# EAGLE design Cartucho Sin Led (EAGLE 9.6.2)
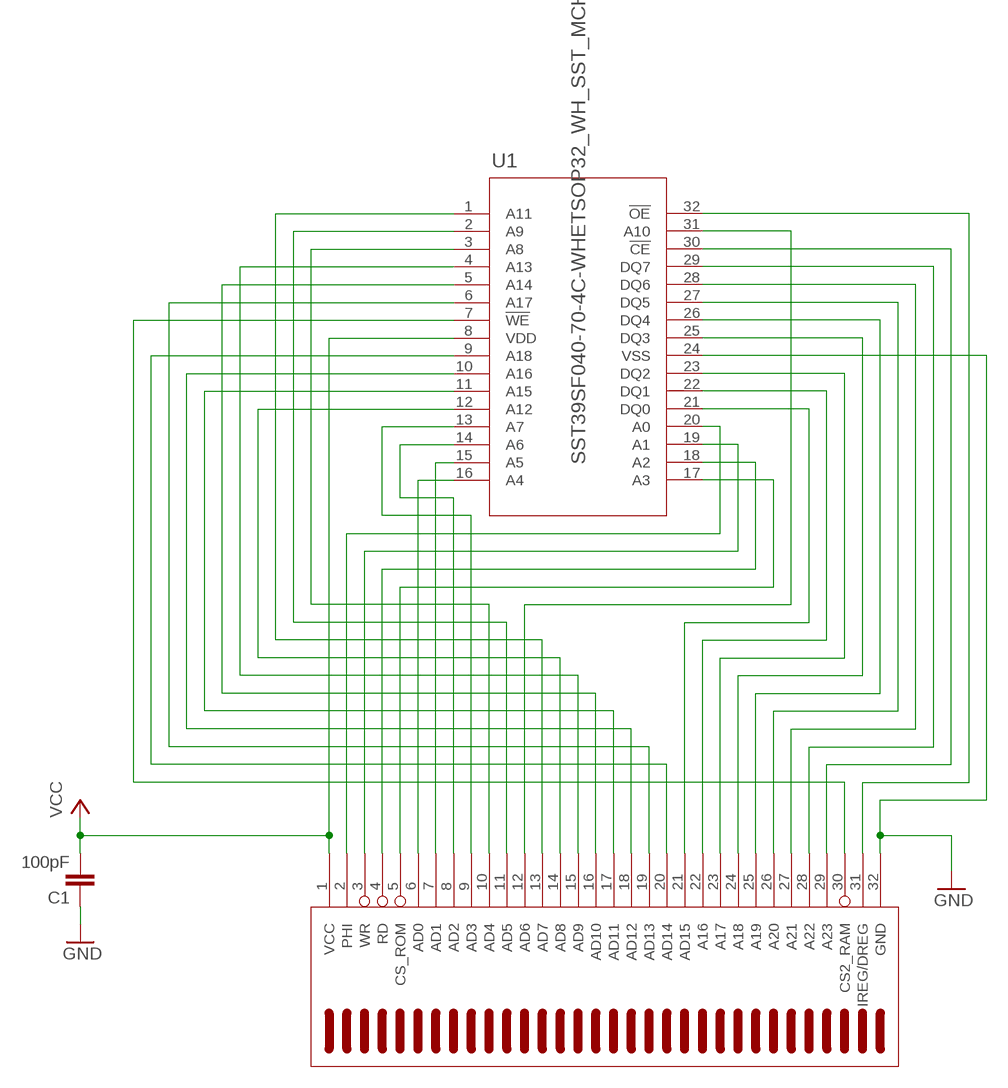
[diagram p0: schematic, sheet 1]

## Parts
C1  100pF  C-EUC0805  [C0805]
U1  SST39SF040-70-4C-WHETSOP32_WH_SST_MCH-M  [TSOP32_WH_SST_MCH-M]
U$1  GBA_CARTNORMAL  [GBA_CART]

## Nets
GND: C1.1 U1.24(VSS) U$1.32(GND)
N$1: U1.20(A0) U$1.2(PHI)
N$2: U1.19(A1) U$1.3(WR)
N$3: U1.18(A2) U$1.4(RD)
N$4: U1.17(A3) U$1.5(CS_ROM)
N$5: U1.16(A4) U$1.6(AD0)
N$6: U1.15(A5) U$1.7(AD1)
N$7: U1.14(A6) U$1.8(AD2)
N$8: U1.13(A7) U$1.9(AD3)
N$9: U1.3(A8) U$1.10(AD4)
N$10: U1.2(A9) U$1.11(AD5)
N$11: U1.31(A10) U$1.12(AD6)
N$12: U1.1(A11) U$1.13(AD7)
N$13: U1.12(A12) U$1.14(AD8)
N$14: U1.4(A13) U$1.15(AD9)
N$15: U1.5(A14) U$1.16(AD10)
N$16: U1.11(A15) U$1.17(AD11)
N$17: U1.10(A16) U$1.18(AD12)
N$18: U1.6(A17) U$1.19(AD13)
N$19: U1.9(A18) U$1.20(AD14)
N$20: U1.21(DQ0) U$1.21(AD15)
N$21: U1.22(DQ1) U$1.22(A16)
N$22: U1.23(DQ2) U$1.23(A17)
N$23: U1.25(DQ3) U$1.24(A18)
N$24: U1.26(DQ4) U$1.25(A19)
N$25: U1.27(DQ5) U$1.26(A20)
N$26: U1.28(DQ6) U$1.27(A21)
N$27: U1.29(DQ7) U$1.28(A22)
N$28: U1.30(!CE) U$1.29(A23)
N$29: U1.7(!WE) U$1.30(CS2_RAM)
N$30: U1.32(!OE) U$1.31(IREG/DREG)
VCC: C1.2 U1.8(VDD) U$1.1(VCC)

## Library data of the parts
C1 = rcl:C-EU: CAPACITOR, European symbol; SPICEPREFIX: C
U1 = SST39SF040:SST39SF040-70-4C-WHE; BUILT_BY: EMA_Jessica; COPYRIGHT: Copyright (C) 2018 Accelerated Designs. All rights reserved; MANUFACTURER_PART_NUMBER: SST39SF040-70-4C-WHE; SOURCELIBRARY: Microchip_2019-08-23_18; VENDOR: Microchip
U$1 = gameboy:GBA_CART

## Board
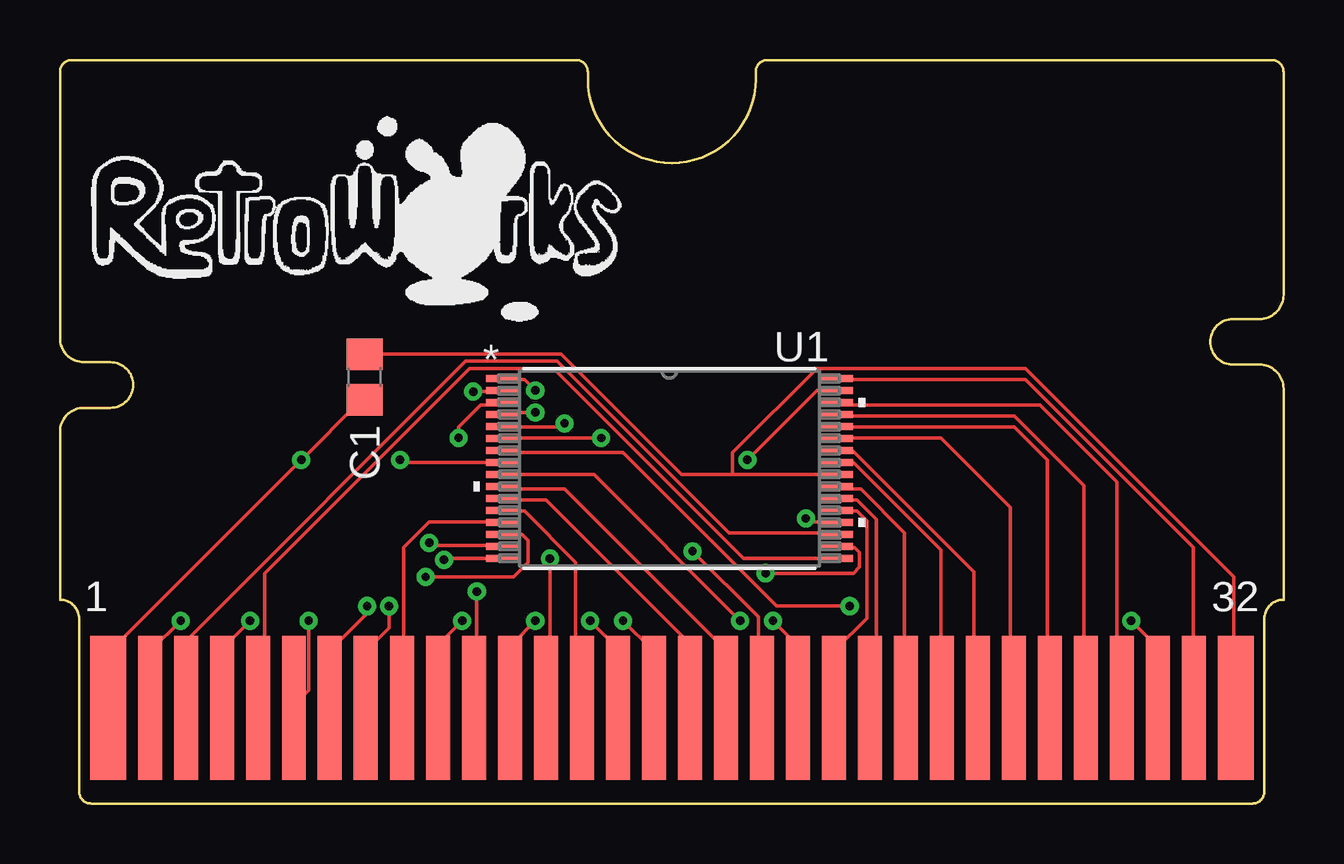
[diagram p1: board, top side]
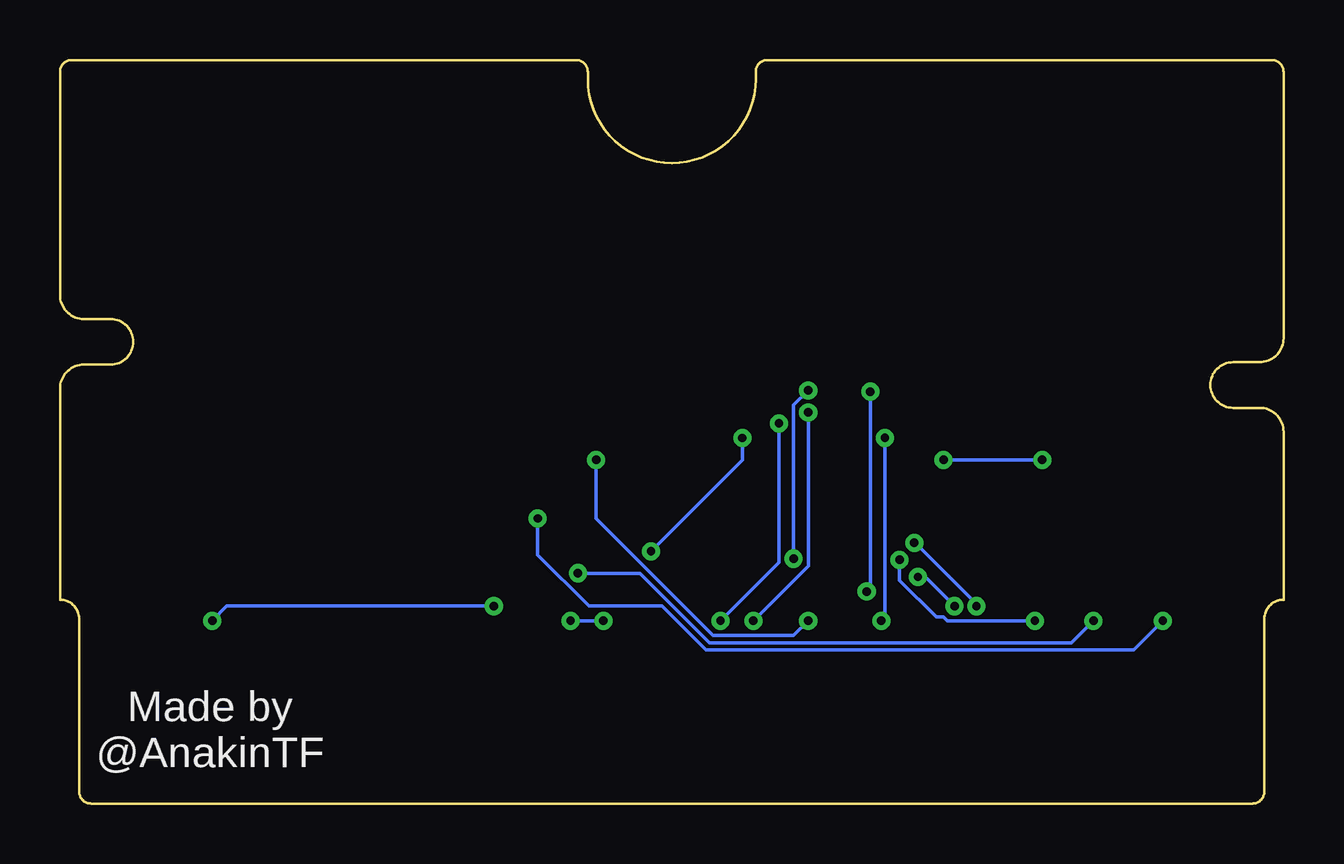
[diagram p2: board, bottom side, seen from below]

Size 51 x 31 mm. Coordinates in mm from the lower left corner, seen from the top.
Copper layers (1*16): Top 0.035mm / dielectric 1.5mm / Bottom 0.035mm
Design rules "default": minimum track width 6mil, minimum drill 0.35mm, track to track 6mil, track to pad 6mil, pad to pad 6mil, via to via 6mil, smd to smd 6mil, copper to edge 40mil, drill to drill 6mil, minimum pad ring 10mil, minimum via ring 8mil, stop-mask expansion 4mil, vias tented up to drill 0mil, thermal gap 10mil

### Footprints (pad centres in the part's own frame; a part is rotated, then mirrored left to right if it is on the bottom)
C0805 = smd 1.3 x 1.5: 1 -0.95,0; 2 0.95,0
TSOP32_WH_SST_MCH-M = smd 1.401 x 0.279: 1 -6.949,3.75; 2 -6.949,3.25; 3 -6.949,2.75; 4 -6.949,2.25; 5 -6.949,1.75; 6 -6.949,1.25; 7 -6.949,0.75; 8 -6.949,0.25; 9 -6.949,-0.25; 10 -6.949,-0.75; 11 -6.949,-1.25; 12 -6.949,-1.75; 13 -6.949,-2.25; 14 -6.949,-2.75; 15 -6.949,-3.25; 16 -6.949,-3.75; 17 6.949,-3.75; 18 6.949,-3.25; 19 6.949,-2.75; 20 6.949,-2.25; 21 6.949,-1.75; 22 6.949,-1.25; 23 6.949,-0.75; 24 6.949,-0.25; 25 6.949,0.25; 26 6.949,0.75; 27 6.949,1.25; 28 6.949,1.75; 29 6.949,2.25; 30 6.949,2.75; 31 6.949,3.25; 32 6.949,3.75
GBA_CART = smd 1.5 x 6: 1 -23.4,0.19; 32 23.6,0.19 | smd 1 x 6: 2 -21.65,0.19; 3 -20.15,0.19; 4 -18.65,0.19; 5 -17.15,0.19; 6 -15.65,0.19; 7 -14.15,0.19; 8 -12.65,0.19; 9 -11.15,0.19; 10 -9.65,0.19; 11 -8.15,0.19; 12 -6.65,0.19; 13 -5.15,0.19; 14 -3.65,0.19; 15 -2.15,0.19; 16 -0.65,0.19; 17 0.85,0.19; 18 2.35,0.19; 19 3.85,0.19; 20 5.35,0.19; 21 6.85,0.19; 22 8.35,0.19; 23 9.85,0.19; 24 11.35,0.19; 25 12.85,0.19; 26 14.35,0.19; 27 15.85,0.19; 28 17.35,0.19; 29 18.85,0.19; 30 20.35,0.19; 31 21.85,0.19

### Placement (x,y rotation side)
C1  12.7,17.78 270 top
U1  25.4,13.97 0 top
U$1  25.4,3.81 0 top
U$2  [ANAKINLOGO]  -15.55,17.9 0 top  (outside the outline)
U$3  [LOGOAMSTRAD20MM]  -15.88,33.92 0 top  (outside the outline)
U$4  [DES28MM]  13.15,37.35 0 top  (outside the outline)
U$5  [RETROWORKS]  0.55,19.55 0 top
U$6  [RETROWORKS]  25.95,44.4 0 bottom  (outside the outline)

### Tracks (layer width: path | path; a pad name or v marks a point on that pad's centre or on a via)
GND
  Top 0.152: 12.65,18.8 C1.1 | 12.8,18.64 C1.1 | 28.04,13.72 25.91,13.72 20.88,18.75 12.7,18.75 C1.1 | 28.04,13.72 32.16,13.72 U1.24 | 28.04,13.72 28.04,14.63 31.55,18.14 40.23,18.14 48.92,9.45 48.92,4.12 U$1.32 | 12.65,18.75 C1.1
N$1  (via drill 0.35)
  Top 0.152: v31.09,11.89 31.24,11.73 32.16,11.73 U1.20 | v5.03,7.62 3.81,6.4 3.81,4.12 U$1.2
  Bottom 0.152: v31.09,11.89 31.09,10.36 28.96,8.23 25.91,8.23 24.08,6.4 6.25,6.4 v5.03,7.62
N$2
  Top 0.152: U1.19 32.16,11.28 27.89,11.28 20.73,18.44 16.92,18.44 5.33,6.86 5.33,4.12 U$1.3
N$3  (via drill 0.35)
  Top 0.152: v29.41,9.6 33.07,9.6 33.32,9.86 33.32,10.46 33.12,10.67 32.31,10.67 U1.18 | v7.92,7.62 6.86,6.55 6.86,4.12 U$1.4
  Bottom 0.152: v29.41,9.6 26.82,9.6 23.93,6.71 8.84,6.71 v7.92,7.62
N$4
  Top 0.152: U1.17 32.16,10.21 28.5,10.21 20.57,18.14 17.07,18.14 8.53,9.6 8.53,4.27 8.38,4.12 U$1.5
N$5  (via drill 0.35)
  Top 0.152: v16,10.16 16.05,10.21 U1.16 | v10.36,7.62 10.36,4.72 9.75,4.12 U$1.6
  Bottom 0.152: v16,10.16 16,9.3 14.48,7.77 14.17,7.77 14.02,7.62 v10.36,7.62
N$6  (via drill 0.35)
  Top 0.152: v15.39,10.87 15.49,10.77 18.45,10.77 U1.15 | v12.8,8.23 12.8,7.92 11.28,6.4 11.28,4.12 U$1.7
  Bottom 0.152: v15.39,10.87 15.34,10.87 12.8,8.33 v12.8,8.23
N$7  (via drill 0.35)
  Top 0.152: U1.14 19.25,11.22 19.51,10.97 19.51,10.06 18.9,9.45 v15.24,9.45 | v13.72,8.23 13.72,7.32 12.8,6.4 12.8,4.12 U$1.8
  Bottom 0.152: v15.24,9.45 14.94,9.45 v13.72,8.23
N$8
  Top 0.152: U1.13 18.44,11.73 15.39,11.73 14.33,10.67 14.33,4.12 U$1.9
N$9  (via drill 0.35)
  Top 0.152: v16.61,15.24 16.61,15.7 17.53,16.61 18.44,16.61 U1.3 | v16.76,7.62 15.85,6.71 15.85,4.12 U$1.10
  Bottom 0.152: v16.61,15.24 16.61,7.77 v16.76,7.62
N$10  (via drill 0.35)
  Top 0.152: U1.2 18.4,17.17 v17.22,17.17 | v17.37,8.84 17.37,4.12 U$1.11
  Bottom 0.152: v17.22,17.17 17.22,8.99 v17.37,8.84
N$11  (via drill 0.35)
  Top 0.152: v28.65,14.33 31.55,17.22 32.16,17.22 U1.31 | v19.81,7.62 18.9,6.71 18.9,4.12 U$1.12
  Bottom 0.152: v28.65,14.33 28.65,11.89 23.77,7.01 20.42,7.01 v19.81,7.62
N$12  (via drill 0.35)
  Top 0.152: v19.81,17.22 19.36,17.68 18.59,17.68 U1.1 | v20.42,10.21 20.42,4.27 20.27,4.12 U$1.13
  Bottom 0.152: v19.81,17.22 20.42,16.61 v20.42,10.21
N$13
  Top 0.152: U1.12 18.59,12.19 19.36,12.19 21.49,10.06 21.49,4.27 21.64,4.12 U$1.14
N$14  (via drill 0.35)
  Top 0.152: v19.81,16.31 18.59,16.31 U1.4 | v22.1,7.62 23.16,6.55 23.16,4.12 U$1.15
  Bottom 0.152: v19.81,16.31 19.81,9.91 v22.1,7.62
N$15  (via drill 0.35)
  Top 0.152: v21.03,15.85 20.88,15.7 18.59,15.7 U1.5 | v23.47,7.62 24.69,6.4 24.69,4.12 U$1.16
  Bottom 0.152: v21.03,15.85 21.03,10.06 v23.47,7.62
N$16
  Top 0.152: U1.11 18.59,12.65 20.27,12.65 26.21,6.71 26.21,4.12 U$1.17
N$17
  Top 0.152: U1.10 18.59,13.11 21.03,13.11 27.74,6.4 27.74,4.12 U$1.18
N$18  (via drill 0.35)
  Top 0.152: v22.55,15.24 18.59,15.24 U1.6 | v26.36,10.52 29.11,7.77 29.11,4.12 U$1.19
  Bottom 0.152: v22.55,15.24 22.55,14.33 v26.36,10.52
N$19  (via drill 0.35)
  Top 0.152: v28.35,7.62 22.25,13.72 18.59,13.72 U1.9 | v29.72,7.62 30.63,6.71 30.63,4.12 U$1.20
  Bottom 0.152: v29.72,7.62 v28.35,7.62
N$20
  Top 0.152: U1.21 32.31,12.19 33.22,12.19 33.63,11.78 33.63,7.72 32.31,6.4 32.31,4.12 U$1.21
N$21
  Top 0.152: U1.22 32.31,12.65 33.22,12.65 34.03,11.84 34.03,4.39 U$1.22
N$22
  Top 0.152: U1.23 32.31,13.11 33.38,13.11 35.2,11.28 35.2,4.12 U$1.23
N$23
  Top 0.152: U1.25 32.4,14.27 33.02,14.27 36.73,10.56 36.73,4.12 U$1.24
N$24
  Top 0.152: U1.26 33.02,14.73 38.1,9.65 38.1,4.12 U$1.25
N$25
  Top 0.152: U1.27 32.31,15.24 36.73,15.24 39.62,12.34 39.62,4.12 U$1.26
N$26
  Top 0.152: U1.28 32.31,15.7 39.78,15.7 41.15,14.33 41.15,4.12 U$1.27
N$27
  Top 0.152: U1.29 32.31,16.15 39.78,16.15 42.67,13.26 42.67,4.12 U$1.28
N$28
  Top 0.152: U1.30 32.31,16.61 40.84,16.61 44.04,13.41 44.04,4.27 44.2,4.12 U$1.29
N$29  (via drill 0.35)
  Top 0.152: v32.92,8.23 29.87,8.23 23.47,14.63 18.59,14.63 U1.7 | v44.65,7.62 45.72,6.55 45.72,4.12 U$1.30
  Bottom 0.152: v32.92,8.23 44.04,8.23 v44.65,7.62
N$30
  Top 0.152: U1.32 32.31,17.68 40.23,17.68 47.24,10.67 47.24,4.12 U$1.31
VCC  (via drill 0.35)
  Top 0.152: 12.65,16.97 C1.2 | v14.17,14.33 14.27,14.23 U1.8 | C1.2 12.56,16.83 12.34,16.61 | 12.34,16.61 10.21,14.48 v10.06,14.33 2.13,6.4 2.13,4.12 U$1.1 | 12.65,16.92 C1.2 | 12.34,16.61 C1.2
  Bottom 0.152: v10.06,14.33 v14.17,14.33

### Text on the board
bPlace: Made by / @AnakinTF
tNames: Diseñado por AnakinTF / para Dandanator / Entertainment / System | V.1.2